# Altium schematic sheet Top.SchDoc
size 406 x 304 mm; SheetNumber: 1; SheetTotal: 6
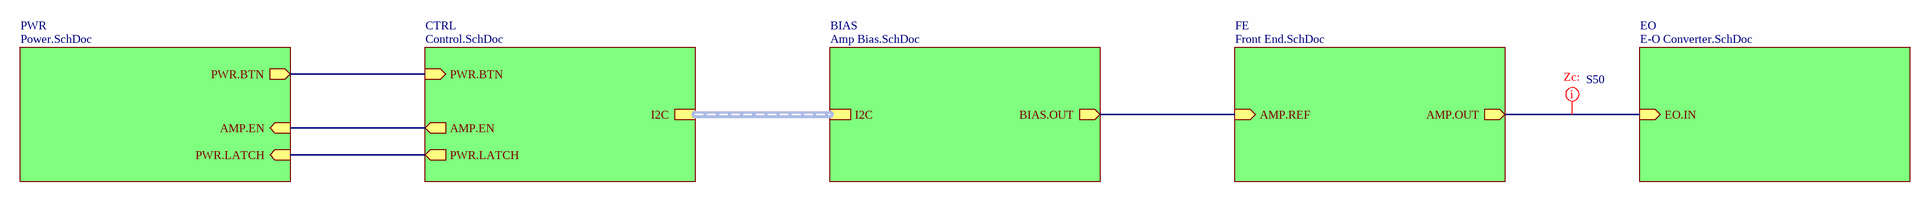
[diagram p0: Top.SchDoc]

## Sub-sheets
BIAS = Amp Bias.SchDoc: BIAS.OUT (out), I2C (harness I2C)
CTRL = Control.SchDoc: PWR.BTN (in), PWR.LATCH (out), AMP.EN (out), I2C (harness I2C)
EO = E-O Converter.SchDoc: EO.IN (in)
FE = Front End.SchDoc: AMP.REF (in), AMP.OUT (out)
PWR = Power.SchDoc: PWR.BTN (out), PWR.LATCH (in), AMP.EN (in)

## Nets
(unnamed): sheet PWR/PWR.BTN, sheet CTRL/PWR.BTN
(unnamed): sheet PWR/PWR.LATCH, sheet CTRL/PWR.LATCH
(unnamed): sheet PWR/AMP.EN, sheet CTRL/AMP.EN
(unnamed): sheet BIAS/BIAS.OUT, sheet FE/AMP.REF
(unnamed): sheet FE/AMP.OUT, sheet EO/EO.IN

## Buses and harness runs
harness sheet BIAS/I2C = sheet CTRL/I2C

## Layout directives
net class S50: (no net found under the mark)

## Notes on the sheet
- Sheet Name:
- Date:
- Sheet
- Designer:
- of